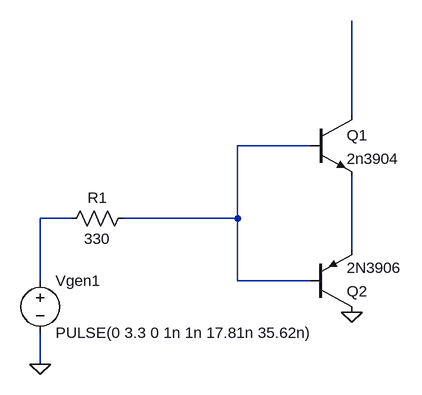
[diagram p0: schematic Draft1.asc]
Draft1.asc, the LTspice schematic file:
Version 4
SHEET 1 880 680
WIRE 352 -32 352 -176
WIRE 288 16 176 16
WIRE 352 176 352 64
WIRE -80 128 -128 128
WIRE 176 128 176 16
WIRE 176 128 0 128
WIRE -128 224 -128 128
WIRE 176 224 176 128
WIRE 288 224 176 224
WIRE -128 352 -128 304
FLAG -128 352 0
FLAG 352 272 0
SYMBOL voltage -128 208 R0
WINDOW 123 24 132 Left 0
WINDOW 39 24 124 Left 2
SYMATTR InstName Vgen1
SYMATTR Value PULSE(0 3.3 0 1n 1n 17.81n 35.62n)
SYMBOL res 16 112 R90
WINDOW 0 0 56 VBottom 2
WINDOW 3 32 56 VTop 2
SYMATTR InstName R1
SYMATTR Value 330
SYMBOL npn 288 -32 R0
SYMATTR InstName Q1
SYMATTR Value 2n3904
SYMBOL pnp 288 272 M180
SYMATTR InstName Q2
SYMATTR Value 2N3906

The netlist it stands for:
* Draft1.asc
Vgen1 N004 0 PULSE(0 3.3 0 1n 1n 17.81n 35.62n)
R1 N002 N004 330
Q1 N001 N002 N003 0 2n3904
Q2 0 N002 N003 0 2N3906
.model NPN NPN
.model PNP PNP
.lib standard.bjt
.backanno
.end